# Altium schematic sheet H-Bridge-control&sense.SchDoc: H-Bridge-control&sense
size A4
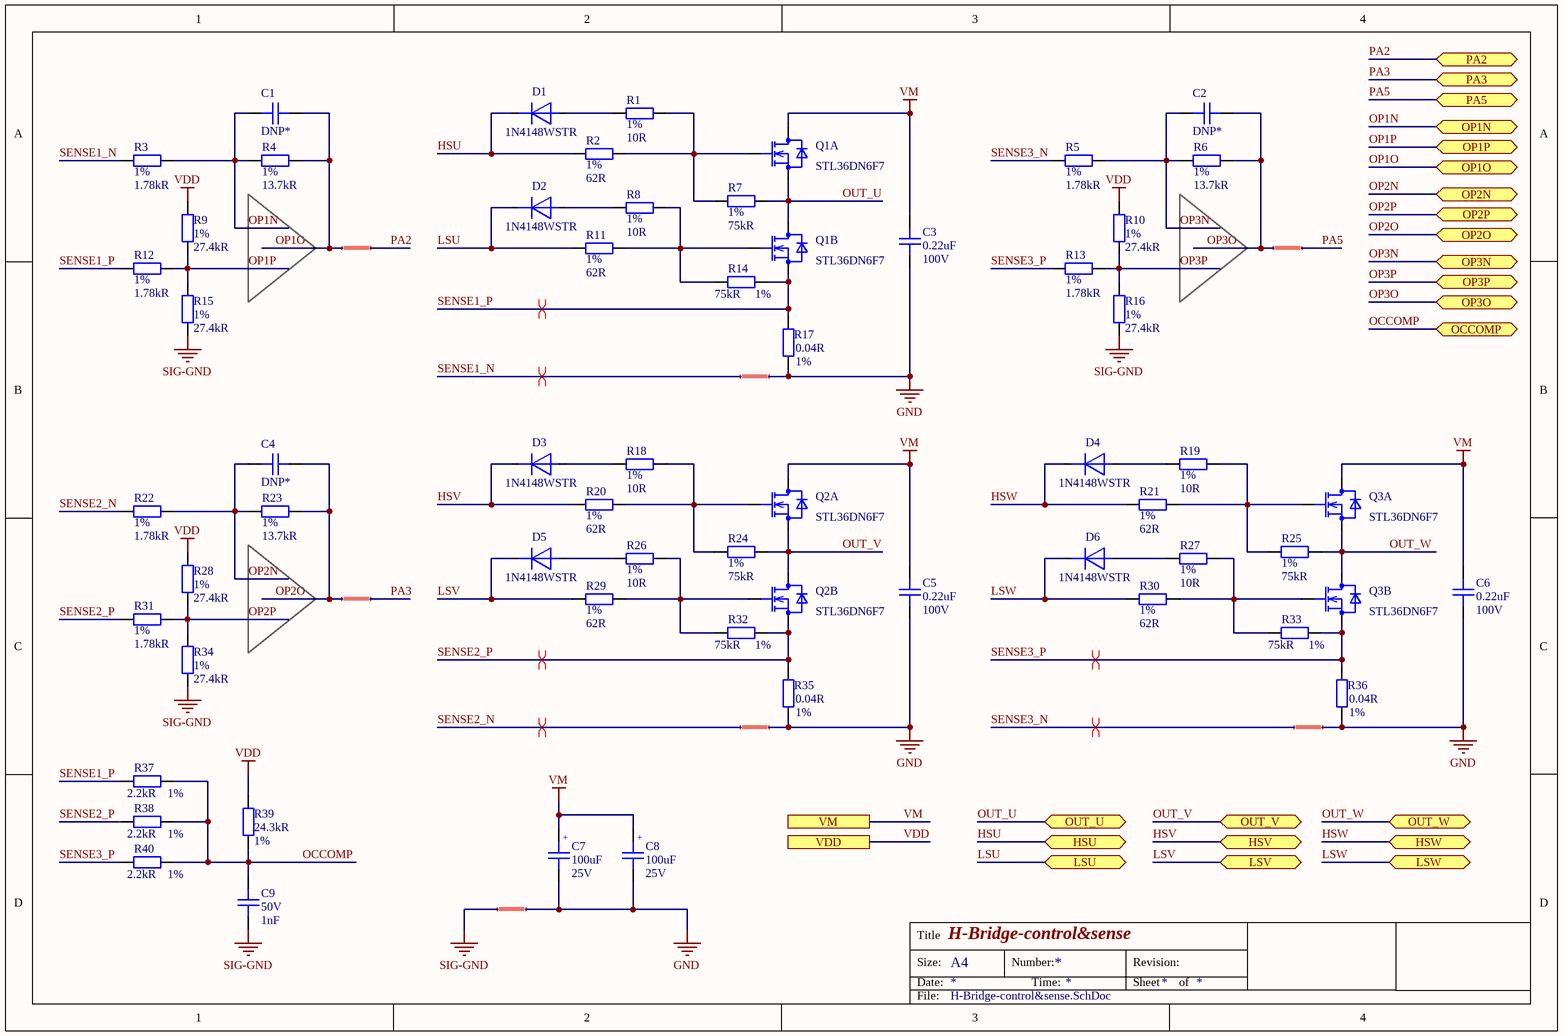
[diagram p0: H-Bridge-control&sense.SchDoc]

## Parts
C1  DNP*  [C0402]  (no BOM)
C2  DNP*  [C0402]  (no BOM)
C3  Capacitance: 0.22uF  Voltage Rating: 100V  [C0805]  (hidden comment: CAP CER 220NF 100V X7R 0805)
C4  DNP*  [C0402]  (no BOM)
C5  Capacitance: 0.22uF  Voltage Rating: 100V  [C0805]  (hidden comment: CAP CER 220NF 100V X7R 0805)
C6  Capacitance: 0.22uF  Voltage Rating: 100V  [C0805]  (hidden comment: CAP CER 220NF 100V X7R 0805)
C7  Capacitance: 100uF  Rated Voltage: 25V  [WCAP-ASLI_8.3X6.5]  (hidden comment: CAP ALUM 100UF 20% 25V SMD)
C8  Capacitance: 100uF  Rated Voltage: 25V  [WCAP-ASLI_8.3X6.5]  (hidden comment: CAP ALUM 100UF 20% 25V SMD)
C9  Voltage Rating (DC): 50V  Capacitance: 1nF  [C0402]  (hidden comment: CAP CER 1000PF 50V X7R 0402)
D1  1N4148WSTR  [SOD-323F]
D2  1N4148WSTR  [SOD-323F]
D3  1N4148WSTR  [SOD-323F]
D4  1N4148WSTR  [SOD-323F]
D5  1N4148WSTR  [SOD-323F]
D6  1N4148WSTR  [SOD-323F]
J1  Net Tie  [Net Tie 6x30mil]  (value not drawn)  (net tie, no BOM)
J2  Net Tie  [Net Tie 6x30mil]  (value not drawn)  (net tie, no BOM)
J3  Net Tie  [Net Tie 6x30mil]  (value not drawn)  (net tie, no BOM)
J4  Net Tie  [Net Tie 6x30mil]  (value not drawn)  (net tie, no BOM)
J5  Net Tie  [Net Tie 6x30mil]  (value not drawn)  (net tie, no BOM)
J6  Net Tie  [Net Tie 6x30mil]  (value not drawn)  (net tie, no BOM)
J7  Net Tie  [Net Tie 6x30mil]  (value not drawn)  (net tie, no BOM)
Q1  STL36DN6F7  [PowerFlat™ (5x6)]  (parts A,B of 2)
Q2  STL36DN6F7  [PowerFlat™ (5x6)]  (parts A,B of 2)
Q3  STL36DN6F7  [PowerFlat™ (5x6)]  (parts A,B of 2)
R1  Tolerance: 1%  Resistance: 10R  [R0402]  (hidden comment: RES SMD 10 OHM 1% 1/16W 0402)
R2  Tolerance: 1%  Resistance: 62R  [R0402]  (hidden comment: RES SMD 62 OHM 1% 1/16W 0402)
R3  Tolerance: 1%  Resistance: 1.78kR  [R0402]  (hidden comment: RES SMD 1.78K OHM 1% 1/16W 0402)
R4  Tolerance: 1%  Resistance: 13.7kR  [R0402]  (hidden comment: RES SMD 13.7K OHM 1% 1/16W 0402)
R5  Tolerance: 1%  Resistance: 1.78kR  [R0402]  (hidden comment: RES SMD 1.78K OHM 1% 1/16W 0402)
R6  Tolerance: 1%  Resistance: 13.7kR  [R0402]  (hidden comment: RES SMD 13.7K OHM 1% 1/16W 0402)
R7  Tolerance: 1%  Resistance: 75kR  [R0402]  (hidden comment: RES SMD 75K OHM 1% 1/16W 0402)
R8  Tolerance: 1%  Resistance: 10R  [R0402]  (hidden comment: RES SMD 10 OHM 1% 1/16W 0402)
R9  Tolerance: 1%  Resistance: 27.4kR  [R0402]  (hidden comment: RES SMD 27.4K OHM 1% 1/16W 0402)
R10  Tolerance: 1%  Resistance: 27.4kR  [R0402]  (hidden comment: RES SMD 27.4K OHM 1% 1/16W 0402)
R11  Tolerance: 1%  Resistance: 62R  [R0402]  (hidden comment: RES SMD 62 OHM 1% 1/16W 0402)
R12  Tolerance: 1%  Resistance: 1.78kR  [R0402]  (hidden comment: RES SMD 1.78K OHM 1% 1/16W 0402)
R13  Tolerance: 1%  Resistance: 1.78kR  [R0402]  (hidden comment: RES SMD 1.78K OHM 1% 1/16W 0402)
R14  Tolerance: 1%  Resistance: 75kR  [R0402]  (hidden comment: RES SMD 75K OHM 1% 1/16W 0402)
R15  Tolerance: 1%  Resistance: 27.4kR  [R0402]  (hidden comment: RES SMD 27.4K OHM 1% 1/16W 0402)
R16  Tolerance: 1%  Resistance: 27.4kR  [R0402]  (hidden comment: RES SMD 27.4K OHM 1% 1/16W 0402)
R17  Tolerance: 1%  Resistance: 0.04R  [R2512]  (hidden comment: RES 0.04 OHM 1% 2W  2512)
R18  Tolerance: 1%  Resistance: 10R  [R0402]  (hidden comment: RES SMD 10 OHM 1% 1/16W 0402)
R19  Tolerance: 1%  Resistance: 10R  [R0402]  (hidden comment: RES SMD 10 OHM 1% 1/16W 0402)
R20  Tolerance: 1%  Resistance: 62R  [R0402]  (hidden comment: RES SMD 62 OHM 1% 1/16W 0402)
R21  Tolerance: 1%  Resistance: 62R  [R0402]  (hidden comment: RES SMD 62 OHM 1% 1/16W 0402)
R22  Tolerance: 1%  Resistance: 1.78kR  [R0402]  (hidden comment: RES SMD 1.78K OHM 1% 1/16W 0402)
R23  Tolerance: 1%  Resistance: 13.7kR  [R0402]  (hidden comment: RES SMD 13.7K OHM 1% 1/16W 0402)
R24  Tolerance: 1%  Resistance: 75kR  [R0402]  (hidden comment: RES SMD 75K OHM 1% 1/16W 0402)
R25  Tolerance: 1%  Resistance: 75kR  [R0402]  (hidden comment: RES SMD 75K OHM 1% 1/16W 0402)
R26  Tolerance: 1%  Resistance: 10R  [R0402]  (hidden comment: RES SMD 10 OHM 1% 1/16W 0402)
R27  Tolerance: 1%  Resistance: 10R  [R0402]  (hidden comment: RES SMD 10 OHM 1% 1/16W 0402)
R28  Tolerance: 1%  Resistance: 27.4kR  [R0402]  (hidden comment: RES SMD 27.4K OHM 1% 1/16W 0402)
R29  Tolerance: 1%  Resistance: 62R  [R0402]  (hidden comment: RES SMD 62 OHM 1% 1/16W 0402)
R30  Tolerance: 1%  Resistance: 62R  [R0402]  (hidden comment: RES SMD 62 OHM 1% 1/16W 0402)
R31  Tolerance: 1%  Resistance: 1.78kR  [R0402]  (hidden comment: RES SMD 1.78K OHM 1% 1/16W 0402)
R32  Tolerance: 1%  Resistance: 75kR  [R0402]  (hidden comment: RES SMD 75K OHM 1% 1/16W 0402)
R33  Tolerance: 1%  Resistance: 75kR  [R0402]  (hidden comment: RES SMD 75K OHM 1% 1/16W 0402)
R34  Tolerance: 1%  Resistance: 27.4kR  [R0402]  (hidden comment: RES SMD 27.4K OHM 1% 1/16W 0402)
R35  Tolerance: 1%  Resistance: 0.04R  [R2512]  (hidden comment: RES 0.04 OHM 1% 2W  2512)
R36  Tolerance: 1%  Resistance: 0.04R  [R2512]  (hidden comment: RES 0.04 OHM 1% 2W  2512)
R37  Tolerance: 1%  Resistance: 2.2kR  [R0402]  (hidden comment: RES SMD 2.2K OHM 1% 1/16W 0402)
R38  Tolerance: 1%  Resistance: 2.2kR  [R0402]  (hidden comment: RES SMD 2.2K OHM 1% 1/16W 0402)
R39  Resistance: 24.3kR  Tolerance: 1%  [R0402]  (hidden comment: RES SMD 24.3K OHM 1% 1/16W 0402)
R40  Tolerance: 1%  Resistance: 2.2kR  [R0402]  (hidden comment: RES SMD 2.2K OHM 1% 1/16W 0402)

## Ports
HSU (bidir), HSV (bidir), HSW (bidir), LSU (bidir), LSV (bidir), LSW (bidir), OCCOMP (bidir), OP1N (bidir), OP1O (bidir), OP1P (bidir), OP2N (bidir), OP2O (bidir), OP2P (bidir), OP3N (bidir), OP3O (bidir), OP3P (bidir), OUT_U (bidir), OUT_V (bidir), OUT_W (bidir), PA2 (bidir), PA3 (bidir), PA5 (bidir), VDD, VM

## Nets
GND: C3.1 C5.1 C6.1 C7.2 C8.2 J3.1 J5.1 J6.1 J7.1 R17.1 R35.1 R36.1
SIG-GND: C9.1 J7.2 R15.1 R16.1 R34.1
VDD: R9.2 R10.2 R28.2 R39.1 ; port VDD
VM: C3.2 C5.2 C6.2 C7.1 C8.1 Q1.5(D1) Q2.5(D1) Q3.5(D1) ; port VM
HSU: D1.1(K) R2.1 ; port HSU
HSV: D3.1(K) R20.1 ; port HSV
HSW: D4.1(K) R21.1 ; port HSW
LSU: D2.1(K) R11.1 ; port LSU
LSV: D5.1(K) R29.1 ; port LSV
LSW: D6.1(K) R30.1 ; port LSW
OCCOMP: C9.2 R37.2 R38.2 R39.2 R40.2 ; port OCCOMP
OP1N: C1.1 R3.2 R4.1 ; port OP1N
OP1O: C1.2 J1.2 R4.2 ; port OP1O
OP1P: R9.1 R12.2 R15.2 ; port OP1P
OP2N: C4.1 R22.2 R23.1 ; port OP2N
OP2O: C4.2 J4.2 R23.2 ; port OP2O
OP2P: R28.1 R31.2 R34.2 ; port OP2P
OP3N: C2.1 R5.2 R6.1 ; port OP3N
OP3O: C2.2 J2.2 R6.2 ; port OP3O
OP3P: R10.1 R13.2 R16.2 ; port OP3P
OUT_U: Q1.3(S1) Q1.7(D1) R7.2 ; port OUT_U
OUT_V: Q2.3(S1) Q2.7(D1) R24.2 ; port OUT_V
OUT_W: Q3.3(S1) Q3.7(D1) R25.2 ; port OUT_W
PA2: J1.1 ; port PA2
PA3: J4.1 ; port PA3
PA5: J2.1 ; port PA5
SENSE1_N: J3.2 R3.1
SENSE1_P: Q1.1(S2) R12.1 R14.2 R17.2 R37.1
SENSE2_N: J5.2 R22.1
SENSE2_P: Q2.1(S2) R31.1 R32.2 R35.2 R38.1
SENSE3_N: J6.2 R5.1
SENSE3_P: Q3.1(S2) R13.1 R33.2 R36.2 R40.1
NetD1_2: D1.2(A) R1.1
NetD2_2: D2.2(A) R8.1
NetD3_2: D3.2(A) R18.1
NetD4_2: D4.2(A) R19.1
NetD5_2: D5.2(A) R26.1
NetD6_2: D6.2(A) R27.1
NetQ1_2: Q1.2(G2) R8.2 R11.2 R14.1
NetQ1_4: Q1.4(G1) R1.2 R2.2 R7.1
NetQ2_2: Q2.2(G2) R26.2 R29.2 R32.1
NetQ2_4: Q2.4(G1) R18.2 R20.2 R24.1
NetQ3_2: Q3.2(G2) R27.2 R30.2 R33.1
NetQ3_4: Q3.4(G1) R19.2 R21.2 R25.1

## Layout directives
differential pair: SENSE1_N, SENSE1_P, SENSE2_N, SENSE2_P, SENSE3_N, SENSE3_P

## Notes on the sheet
- Title
- Size:
- Date:
- A4
- Number:
- Time:
- Revision:
- Sheet
- of
- File:
- (in symbol CAP ALUM 220UF 20% 25V SMD) +

## Library data of the parts
C1 C2 C4 = CAP CER NO_BOM 0402: Placeholder for a 0402 capacitor
C3 C5 C6 = CAP CER 220NF 100V X7R 0805: 0.22 µF ±10% 100V Ceramic Capacitor X7R 0805 (2012 Metric); Manufacturer: KEMET; Manufacturer Part Number: C0805C224K1RECAUTO; Supplier 1: Digi-Key; Stock 1: 251380; Pricing 1: 1=0.3, 10=0.207, 100=0.1173, 500=0.0828, 1000=0.0725 (USD); Mount: Surface Mount; Case/Package: 0805; Case Code (Metric): 2012; Case Code (Imperial): 0805; Material: Ceramic; Min Operating Temperature: -55°C; Max Operating Temperature: 125°C; Tolerance: 10%; Packaging: Tape and Reel; Package Quantity: 2500; Length: 0.079inch; Width: 0.049inch; Thickness: 0.055inch; Depth: 1.25mm; Lead Free: Lead Free; ComponentLink1URL: https://www.digikey.com/en/products/detail/kemet/C0805C224K1RECAUTO/8640484; ComponentLink1Description: https://www.digikey.com/en/products/detail/kemet/C0805C224K1RECAUTO/8640484; Supplier Part Number 1: 399-17890-1-ND; Dielectric: X7R
C7 C8 = CAP ALUM 220UF 20% 25V SMD: 100 µF 25 V Aluminum Electrolytic Capacitors Radial, Can - SMD 260mOhm @ 100kHz 2000 Hrs @ 105°C; Manufacturer: Panasonic Electronic Components; Manufacturer Part Number: EEE-FK1E101V; Endurance: 2000h; Capacitance Tolerance: +/-20%; Packaging: Tape and Reel; Diameter: 8mm; Height: 6.5mm; Mounting Technology: SMT; Operating Temperature: -40 to +105degC; Published Date: May 2020; Mount: Surface Mount; Supplier 1: Newark; Supplier Part Number 1: 38AC1087
C9 = CAP CER 1000PF 50V X7R 0402: 1000pF ±10% 50V Ceramic Capacitor X7R 0402 (1005 Metric); Manufacturer: TDK-Lambda; Manufacturer Part Number: C0402C102K5RACTU; Supplier 1: Digi-Key; Stock 1: 1578852; Pricing 1: 1=0.1, 10=0.021, 50=0.0116, 100=0.0095, 500=0.0068, 1000=0.0053, 2500=0.0048, 5000=0.0045 (USD); Case/Package: 0402; Number of Pins: 2; Dielectric Material: Ceramic; Dielectric: X7R; Packaging: Cut Tape; Tolerance: 10%; Length: 1mm; Height: 500um; Width: 500um; REACH SVHC: No SVHC; ComponentLink1URL: http://www.onlinecomponents.com/productFiles/mf-KEM/kem_c1002_x7r_smd.pdf?src-supplier=Onlinecomponents.com; ComponentLink1Description: http://www.onlinecomponents.com/productFiles/mf-KEM/kem_c1002_x7r_smd.pdf?src-supplier=Onlinecomponents.com; Supplier Part Number 1: 399-1032-6-ND; Mount: Surface Mount
D1-D6 = DIODE GEN PURP 75V 300MA SOD323: Diode Standard 75 V 300mA (DC) Surface Mount SOD-323; Manufacturer: SMC Diode Solutions; Forward Voltage: 350mV; Max Surge Current: 500mA; Max Reverse Leakage Current: 2.5uA; Max Repetitive Reverse Voltage (Vrrm): 75V; Element Configuration: Single; Supplier 1: Digi-Key; Manufacturer Part Number: 1N4148WSTR; Stock 1: 28802; Pricing 1: 1=0.36, 10=0.27, 25=0.2368, 100=0.1284, 500=0.1048, 1000=0.0777, 2500=0.0683 (USD); Case/Package: SC-90, SOD-323F; Number of Pins: 2; Contact Plating: Tin,Matte; Min Operating Temperature: -65°C; Max Operating Temperature: 100°C; Forward Current: 300mA; Package Quantity: 1; Packaging: Tape and Reel; Average Rectified Current: 300mA; Peak Non-Repetitive Surge Current: 500mA; Max Forward Surge Current (Ifsm): 500mA; Termination: SMD/SMT; Max Reverse Voltage (DC): 75V; Radiation Hardening: No; REACH SVHC: No SVHC; Lead Free: Lead Free; ComponentLink1URL: https://www.digikey.com/en/products/detail/smc-diode-solutions/1N4148WSTR/6022449?s=N4IgTCBcDaIIwDYCsSC0cDMSCc7UDsATEAXQF8g; ComponentLink1Description: https://www.digikey.com/en/products/detail/smc-diode-solutions/1N4148WSTR/6022449?s=N4IgTCBcDaIIwDYCsSC0cDMSCc7UDsATEAXQF8g; Supplier Part Number 1: 1655-1359-1-ND; Mount: Surface Mount
J1-J7 = Net Tie Line: ClassName: Net Tie
Q1-Q3 = ARRAY MOSFET 2N-CH 60V 33A POWERFLAT: Mosfet Array 2 N-Channel (Dual) 60V 33A (Tc) 58W Surface Mount PowerFlat™ (5x6); Manufacturer: STMicroelectronics; Gate to Source Voltage (Vgs): 20V; Rds On Max: 1.2R; Input Capacitance: 420pF; Number of Channels: 2; Supplier 1: Digi-Key; Manufacturer Part Number: STL36DN6F7; Stock 1: 141366; Pricing 1: 1=0.39, 10=0.338, 25=0.3152, 100=0.234, 500=0.1827, 1000=0.1485 (USD); Mount: Surface Mount; Min Operating Temperature: -55°C; Max Operating Temperature: 150°C; Continuous Drain Current (ID): 33A; Package Quantity: 3000; Packaging: Tape and Reel; Drain to Source Voltage (Vdss): 60V; Max Power Dissipation: 58W; Drain to Source Breakdown Voltage: 60V; Drain to Source Resistance: 1.2R; Element Configuration: Dual; FET Type: 2 N-Channel; Length: 1.6mm; Height: 0.6mm; Width: 1.2mm; Radiation Hardening: No; REACH SVHC: No SVHC; ComponentLink1URL: https://www.digikey.com/en/products/detail/stmicroelectronics/STL36DN6F7/7360914; ComponentLink1Description: https://www.digikey.com/en/products/detail/stmicroelectronics/STL36DN6F7/7360914; Supplier Part Number 1: DMN32D2LV-7DICT-ND; Case/Package: 8-PowerVDFN; Weight: 0.000106oz; Polarity: N-CHANNEL; Series: -; ClassName: TCPP
R1 R8 R18 R19 R26 R27 = RES SMD 10 OHM 1% 1/16W 0402: 10 Ohms ±1% 0.063W, 1/16W Chip Resistor 0402 (1005 Metric) Automotive AEC-Q200, Moisture Resistant Thick Film; Manufacturer: Yageo; Manufacturer Part Number: AC0402FR-0710RL; Power Rating: 62.5mW; Voltage Rating: 50V; Temperature Coefficient: 200ppm/°C; Max Power Dissipation: 63mW; Supplier 1: Digi-Key; Stock 1: 5005874; Pricing 1: 1=0.1, 10=0.014, 100=0.0058, 1000=0.0026, 2500=0.0023, 5000=0.0019 (USD); Case/Package: 0402; Number of Pins: 2; Weight: 2.3E-05oz; Case Code (Imperial): 0402; Case Code (Metric): 1005; Min Operating Temperature: -55°C; Max Operating Temperature: 155°C; Packaging: Tape and Reel; Package Quantity: 1; Termination: SMD/SMT; Resistor Type: Thick Film; Number of Terminations: 2; Features: Moisture Resistant; Voltage Rating (DC): 50V; Length: 1mm; Height: 0.016inch; Width: 0.5mm; Depth: 0.5mm; REACH SVHC: No SVHC; Military Standard: Not; Lead Free: Lead Free; ComponentLink1URL: https://www.digikey.com/en/products/detail/yageo/AC0402FR-0710RL/5895033?s=N4IgTCBcDaIIYGMAMAWJYBmAnAtEg7AIxJYA2IAugL5A; ComponentLink1Description: https://www.digikey.com/en/products/detail/yageo/AC0402FR-0710RL/5895033?s=N4IgTCBcDaIIYGMAMAWJYBmAnAtEg7AIxJYA2IAugL5A; Supplier Part Number 1: YAG3438CT-ND; Mount: Surface Mount
R2 R11 R20 R21 R29 R30 = RES SMD 62 OHM 1% 1/16W 0402: 62 Ohms ±1% 0.063W, 1/16W Chip Resistor 0402 (1005 Metric) Automotive AEC-Q200, Moisture Resistant Thick Film; Manufacturer: Yageo; Manufacturer Part Number: AC0402FR-0762RL; Power Rating: 62.5mW; Voltage Rating: 50V; Temperature Coefficient: 200ppm/°C; Max Power Dissipation: 63mW; Supplier 1: Digi-Key; Stock 1: 5005874; Pricing 1: 1=0.1, 10=0.014, 100=0.0058, 1000=0.0026, 2500=0.0023, 5000=0.0019 (USD); Case/Package: 0402; Number of Pins: 2; Weight: 2.3E-05oz; Case Code (Imperial): 0402; Case Code (Metric): 1005; Min Operating Temperature: -55°C; Max Operating Temperature: 155°C; Packaging: Tape and Reel; Package Quantity: 1; Termination: SMD/SMT; Resistor Type: Thick Film; Number of Terminations: 2; Features: Moisture Resistant; Voltage Rating (DC): 50V; Length: 1mm; Height: 0.016inch; Width: 0.5mm; Depth: 0.5mm; REACH SVHC: No SVHC; Military Standard: Not; Lead Free: Lead Free; ComponentLink1URL: https://www.digikey.com/en/products/detail/yageo/AC0402FR-0710RL/5895033?s=N4IgTCBcDaIIYGMAMAWJYBmAnAtEg7AIxJYA2IAugL5A; ComponentLink1Description: https://www.digikey.com/en/products/detail/yageo/AC0402FR-0762RL/5895461?s=N4IgTCBcDaIIIGEAMAWJYBiAlAtEg7AGxhYAyIAugL5A; Supplier Part Number 1: 13-AC0402FR-0762RLCT-ND; Mount: Surface Mount
R3 R5 R12 R13 R22 R31 = RES SMD 1.78K OHM 1% 1/16W 0402: 1.78 kOhms ±1% 0.063W, 1/16W Chip Resistor 0402 (1005 Metric) Automotive AEC-Q200, Moisture Resistant Thick Film; Manufacturer: Yageo; Manufacturer Part Number: AC0402FR-071K78L; Power Rating: 62.5mW; Voltage Rating: 50V; Temperature Coefficient: 200ppm/°C; Max Power Dissipation: 63mW; Supplier 1: Digi-Key; Stock 1: 5005874; Pricing 1: 1=0.1, 10=0.014, 100=0.0058, 1000=0.0026, 2500=0.0023, 5000=0.0019 (USD); Case/Package: 0402; Number of Pins: 2; Weight: 2.3E-05oz; Case Code (Imperial): 0402; Case Code (Metric): 1005; Min Operating Temperature: -55°C; Max Operating Temperature: 155°C; Packaging: Tape and Reel; Package Quantity: 1; Termination: SMD/SMT; Resistor Type: Thick Film; Number of Terminations: 2; Features: Moisture Resistant; Voltage Rating (DC): 50V; Length: 1mm; Height: 0.016inch; Width: 0.5mm; Depth: 0.5mm; REACH SVHC: No SVHC; Military Standard: Not; Lead Free: Lead Free; ComponentLink1URL: https://www.digikey.com/en/products/detail/yageo/AC0402FR-071K78L/5895149?s=N4IgTCBcDaIIIGEAMAWJYBiAlAtEg7AIwDW%2BAHADIgC6AvkA; ComponentLink1Description: https://www.digikey.com/en/products/detail/yageo/AC0402FR-0762RL/5895461?s=N4IgTCBcDaIIIGEAMAWJYBiAlAtEg7AGxhYAyIAugL5A; Supplier Part Number 1: AC0402FR-071K78L-ND; Mount: Surface Mount
R4 R6 R23 = RES SMD 13.7K OHM 1% 1/16W 0402: 13.7 kOhms ±1% 0.063W, 1/16W Chip Resistor 0402 (1005 Metric) Automotive AEC-Q200, Moisture Resistant Thick Film; Manufacturer: Yageo; Manufacturer Part Number: AC0402FR-0713K7L; Power Rating: 62.5mW; Voltage Rating: 50V; Temperature Coefficient: 200ppm/°C; Max Power Dissipation: 63mW; Supplier 1: Digi-Key; Stock 1: 5005874; Pricing 1: 1=0.1, 10=0.014, 100=0.0058, 1000=0.0026, 2500=0.0023, 5000=0.0019 (USD); Case/Package: 0402; Number of Pins: 2; Weight: 2.3E-05oz; Case Code (Imperial): 0402; Case Code (Metric): 1005; Min Operating Temperature: -55°C; Max Operating Temperature: 155°C; Packaging: Tape and Reel; Package Quantity: 1; Termination: SMD/SMT; Resistor Type: Thick Film; Number of Terminations: 2; Features: Moisture Resistant; Voltage Rating (DC): 50V; Length: 1mm; Height: 0.016inch; Width: 0.5mm; Depth: 0.5mm; REACH SVHC: No SVHC; Military Standard: Not; Lead Free: Lead Free; ComponentLink1URL: https://www.digikey.com/en/products/detail/yageo/AC0402FR-0713K7L/5895067?s=N4IgTCBcDaIIIGEAMAWJYBiAlAtEg7AIwDMA0vgDIgC6AvkA; ComponentLink1Description: https://www.digikey.com/en/products/detail/yageo/AC0402FR-0713K7L/5895067?s=N4IgTCBcDaIIIGEAMAWJYBiAlAtEg7AIwDMA0vgDIgC6AvkA; Supplier Part Number 1: 13-AC0402FR-0713K7LCT-ND; Mount: Surface Mount
R7 R14 R24 R25 R32 R33 = RES SMD 75K OHM 1% 1/16W 0402: 75 kOhms ±1% 0.063W, 1/16W Chip Resistor 0402 (1005 Metric) Automotive AEC-Q200 Thick Film; Manufacturer: Stackpole Electronics; Manufacturer Part Number: RMCF0402FT75K0; Power Rating: 63mW; Temperature Coefficient: 100ppm/°C; Supplier 1: Digi-Key; Stock 1: 24693; Pricing 1: 1=0.1, 10=0.014, 100=0.0058, 1000=0.0026, 2500=0.0023, 5000=0.0019 (USD); Mount: Surface Mount; Case/Package: 0402; Case Code (Metric): 1005; Case Code (Imperial): 0402; Contact Plating: Tin,Matte; Min Operating Temperature: -55°C; Max Operating Temperature: 155°C; Features: Automotive AEC-Q200; Packaging: Tape and Reel; Composition: Thick Film; Number of Terminations: 2; Military Standard: Not; Max Power Dissipation: 63mW; Length: 0.039inch; Height: 0.016inch; Width: 0.02inch; Depth: 0.5mm; Radiation Hardening: No; Lead Free: Lead Free; ComponentLink1URL: https://www.seielect.com/catalog/SEI-Packaging.pdf?src-supplier=Digi-Key; ComponentLink1Description: https://www.seielect.com/catalog/SEI-Packaging.pdf?src-supplier=Digi-Key; ComponentLink2URL: http://www.seielect.com/Catalog/Sei-RMC.pdf?src-supplier=Future+Electronics; ComponentLink2Description: http://www.seielect.com/Catalog/Sei-RMC.pdf?src-supplier=Future+Electronics; ComponentLink3URL: https://www.seielect.com/catalog/SEI-RMCF_RMCP.pdf?src-supplier=Avnet; ComponentLink3Description: https://www.seielect.com/catalog/SEI-RMCF_RMCP.pdf?src-supplier=Avnet; ComponentLink4URL: http://components.arrow.com/part/dataview/47811039S7743759N1174?src-supplier=Arrow; ComponentLink4Description: http://components.arrow.com/part/dataview/47811039S7743759N1174?src-supplier=Arrow; ComponentLink5URL: https://www.verical.com/server-webapp/html/getDatasheet?partID=492569&src-supplier=Verical; ComponentLink5Description: https://www.verical.com/server-webapp/html/getDatasheet?partID=492569&src-supplier=Verical; Supplier Part Number 1: RMCF0402FT75K0CT-ND; ClassName: STM32G473CETx
R9 R10 R15 R16 R28 R34 = RES SMD 27.4K OHM 1% 1/16W 0402: 27.4 kOhms ±1% 0.063W, 1/16W Chip Resistor 0402 (1005 Metric) Automotive AEC-Q200, Moisture Resistant Thick Film; Manufacturer: Yageo; Manufacturer Part Number: AC0402FR-0727K4L; Power Rating: 62.5mW; Voltage Rating: 50V; Temperature Coefficient: 200ppm/°C; Max Power Dissipation: 63mW; Supplier 1: Digi-Key; Stock 1: 5005874; Pricing 1: 1=0.1, 10=0.014, 100=0.0058, 1000=0.0026, 2500=0.0023, 5000=0.0019 (USD); Case/Package: 0402; Number of Pins: 2; Weight: 2.3E-05oz; Case Code (Imperial): 0402; Case Code (Metric): 1005; Min Operating Temperature: -55°C; Max Operating Temperature: 155°C; Packaging: Tape and Reel; Package Quantity: 1; Termination: SMD/SMT; Resistor Type: Thick Film; Number of Terminations: 2; Features: Moisture Resistant; Voltage Rating (DC): 50V; Length: 1mm; Height: 0.016inch; Width: 0.5mm; Depth: 0.5mm; REACH SVHC: No SVHC; Military Standard: Not; Lead Free: Lead Free; ComponentLink1URL: https://www.digikey.com/en/products/detail/yageo/AC0402FR-0727K4L/5895227?s=N4IgTCBcDaIIIGEAMAWJYBiAlAtEg7GPgNYoAyIAugL5A; ComponentLink1Description: https://www.digikey.com/en/products/detail/yageo/AC0402FR-0727K4L/5895227?s=N4IgTCBcDaIIIGEAMAWJYBiAlAtEg7GPgNYoAyIAugL5A; Supplier Part Number 1: 13-AC0402FR-0727K4LCT-ND; Mount: Surface Mount
R17 R35 R36 = RES 0.04 OHM 1% 2W  2512: 40 mOhms ±1% 2W Chip Resistor 2512 (6432 Metric) Current Sense, Non-Inductive Metal Element; Manufacturer: Stackpole Electronics Inc; Manufacturer Part Number: CSR2512A0R04F; Voltage Rating: 200V; Temperature Coefficient: 50ppm/°C; Supplier 1: Digi-Key; Stock 1: 5005874; Pricing 1: 1=0.1, 10=0.014, 100=0.0058, 1000=0.0026, 2500=0.0023, 5000=0.0019 (USD); Case/Package: 2512; Number of Pins: 2; Weight: 2.3E-05oz; Case Code (Imperial): 2512; Case Code (Metric): 6432; Min Operating Temperature: -55°C; Max Operating Temperature: 155°C; Power Rating: 2W; Packaging: Tape and Reel; Package Quantity: 1; Termination: SMD/SMT; Resistor Type: Thick Film; Number of Terminations: 2; Features: Moisture Resistant; Voltage Rating (DC): 200V; REACH SVHC: No SVHC; Military Standard: Not; Lead Free: Lead Free; ComponentLink1URL: https://www.digikey.com/en/products/detail/riedon/CSR2512A0R04F/5723630?s=N4IgTCBcDaIMIGUBKYCsBGMBBADEnALAGIgC6AvkA; ComponentLink1Description: https://www.digikey.com/en/products/detail/riedon/CSR2512A0R04F/5723630?s=N4IgTCBcDaIMIGUBKYCsBGMBBADEnALAGIgC6AvkA; Supplier Part Number 1: 696-1668-2-ND; Mount: Surface Mount
R37 R38 R40 = RES SMD 2.2K OHM 1% 1/16W 0402: 2.2 kOhms ±1% 0.063W, 1/16W Chip Resistor 0402 (1005 Metric) Automotive AEC-Q200, Moisture Resistant Thick Film; Manufacturer: Yageo; Manufacturer Part Number: AC0402FR-072K2L; Power Rating: 62.5mW; Voltage Rating: 50V; Temperature Coefficient: 200ppm/°C; Max Power Dissipation: 63mW; Supplier 1: Digi-Key; Stock 1: 5005874; Pricing 1: 1=0.1, 10=0.014, 100=0.0058, 1000=0.0026, 2500=0.0023, 5000=0.0019 (USD); Case/Package: 0402; Number of Pins: 2; Weight: 2.3E-05oz; Case Code (Imperial): 0402; Case Code (Metric): 1005; Min Operating Temperature: -55°C; Max Operating Temperature: 155°C; Packaging: Tape and Reel; Package Quantity: 1; Termination: SMD/SMT; Resistor Type: Thick Film; Number of Terminations: 2; Features: Moisture Resistant; Voltage Rating (DC): 50V; Length: 1mm; Height: 0.016inch; Width: 0.5mm; Depth: 0.5mm; REACH SVHC: No SVHC; Military Standard: Not; Lead Free: Lead Free; ComponentLink1URL: https://www.digikey.com/en/products/detail/yageo/AC0402FR-072K2L/5895245?s=N4IgTCBcDaIIIGEAMAWJYBiAlAtEg7GANJgAyIAugL5A; ComponentLink1Description: https://www.digikey.com/en/products/detail/yageo/AC0402FR-072K2L/5895245?s=N4IgTCBcDaIIIGEAMAWJYBiAlAtEg7GANJgAyIAugL5A; Supplier Part Number 1: YAG3467CT-ND; Mount: Surface Mount
R39 = RES SMD 24.3K OHM 1% 1/16W 0402: 24.3 ±1% 0.063W, 1/16W Chip Resistor 0402 (1005 Metric) Moisture Resistant Thick Film; Manufacturer: Yageo; Manufacturer Part Number: RC0402FR-0724K3L; Power Rating: 62.5mW; Voltage Rating: 50V; Max Power Dissipation: 63mW; Temperature Coefficient: 100ppm/°C; Supplier 1: Digi-Key; Stock 1: 58499; Pricing 1: 1=0.1, 10=0.016, 100=0.0064, 1000=0.0029, 2500=0.0025, 5000=0.0021 (USD); Case/Package: 0402; Weight: 2.3E-05oz; Case Code (Imperial): 0402; Case Code (Metric): 1005; Contact Plating: Tin,Matte; Min Operating Temperature: -55°C; Max Operating Temperature: 155°C; Packaging: Tape and Reel; Composition: Thick Film; Number of Terminations: 2; Termination: SMD/SMT; Military Standard: Not; Voltage Rating (DC): 50V; Features: Moisture Resistant; Length: 1mm; Height: 0.016inch; Width: 0.02inch; Depth: 0.5mm; Radiation Hardening: No; Lead Free: Lead Free; ComponentLink1URL: https://www.digikey.com/en/products/detail/yageo/RC0402FR-0724K3L/5280931; ComponentLink1Description: https://www.digikey.com/en/products/detail/yageo/RC0402FR-0724K3L/5280931; Supplier Part Number 1: YAG3071TR-ND; Mount: Surface Mount